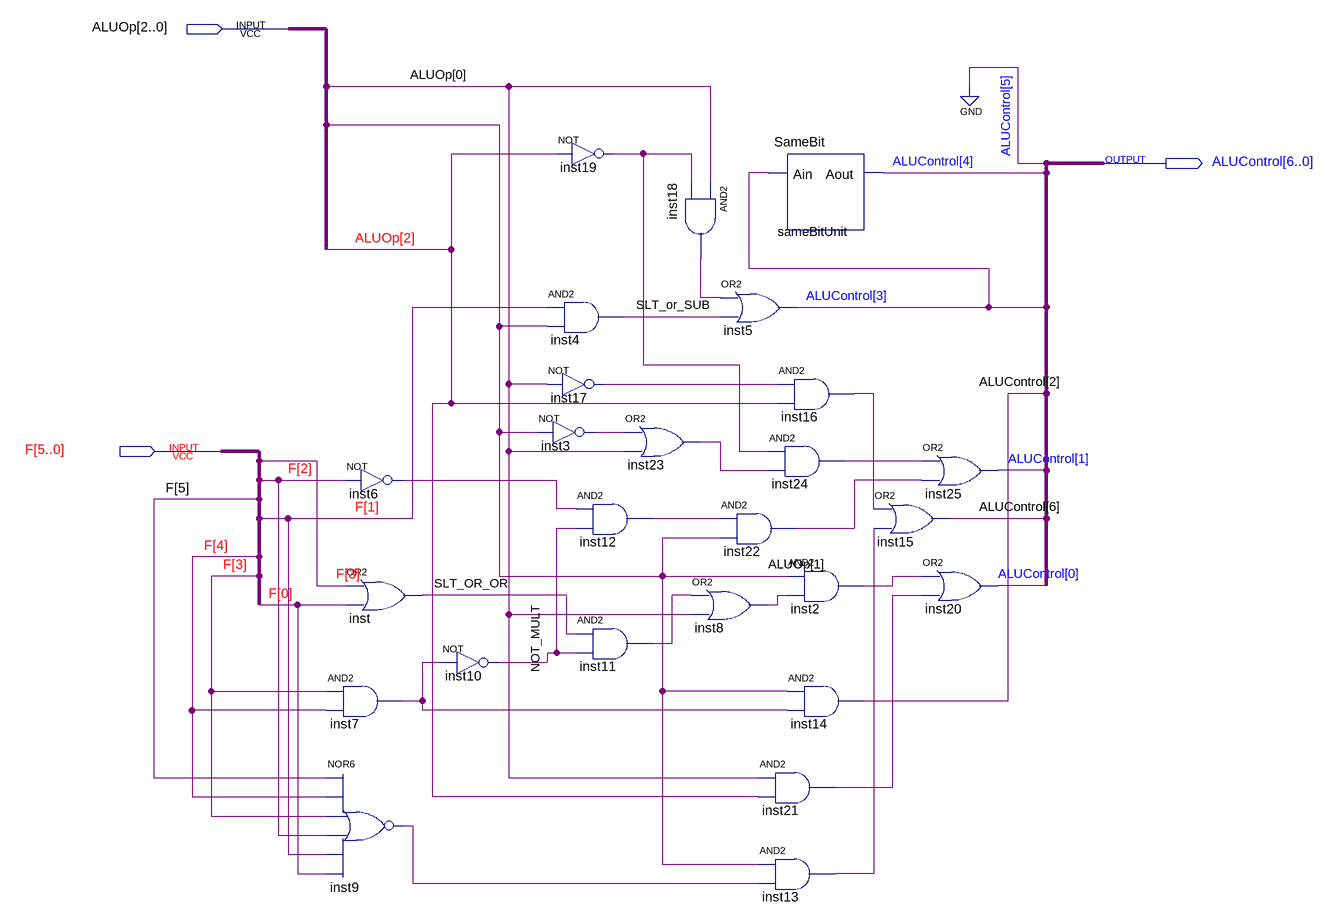
[diagram p0: schematic sheet]
// Quartus schematic ALUCtl.bdf as structural Verilog: 26 symbols, 3 pins
module ALUCtl (
  input  [2:0] ALUOp,
  input  [5:0] F,
  output [6:0] ALUControl
);

  wire inst2_out, inst3_out, inst6_out, inst7_out, inst8_out, inst9_out, inst12_out, inst13_out, inst16_out,
       inst17_out, inst18_out, inst19_out, inst21_out, inst22_out, inst23_out, inst24_out, inst_out,
       NOT_MULT, SLT_OR_OR, SLT_or_SUB;

  not inst6 (inst6_out, F[2]);
  or inst (inst_out, F[3], F[0]);
  and inst7 (inst7_out, F[3], F[4]);
  nor inst9 (inst9_out, F[5], F[4], F[3], F[2], F[1], F[0]);
  not inst10 (NOT_MULT, inst7_out);
  not inst19 (inst19_out, ALUOp[2]);
  and inst4 (SLT_or_SUB, F[1], ALUOp[1]);
  not inst17 (inst17_out, ALUOp[0]);
  not inst3 (inst3_out, ALUOp[1]);
  and inst12 (inst12_out, inst6_out, NOT_MULT);
  and inst11 (SLT_OR_OR, inst_out, NOT_MULT);
  and inst18 (inst18_out, ALUOp[0], inst19_out);
  or inst23 (inst23_out, inst3_out, ALUOp[0]);
  or inst5 (ALUControl[3], inst18_out, SLT_or_SUB);
  and inst22 (inst22_out, inst12_out, ALUOp[1]);
  or inst8 (inst8_out, SLT_OR_OR, ALUOp[0]);
  SameBit sameBitUnit (.Ain(ALUControl[3]), .Aout(ALUControl[4]));
  and inst16 (inst16_out, inst17_out, ALUOp[2]);
  and inst24 (inst24_out, inst19_out, inst23_out);
  and inst2 (inst2_out, ALUOp[1], inst8_out);
  and inst14 (ALUControl[2], ALUOp[1], inst7_out);
  and inst21 (inst21_out, ALUOp[0], ALUOp[2]);
  and inst13 (inst13_out, ALUOp[1], inst9_out);
  or inst15 (ALUControl[6], inst16_out, inst13_out);
  or inst25 (ALUControl[1], inst24_out, inst22_out);
  or inst20 (ALUControl[0], inst2_out, inst21_out);

  assign ALUControl[5] = 1'b0;
endmodule
